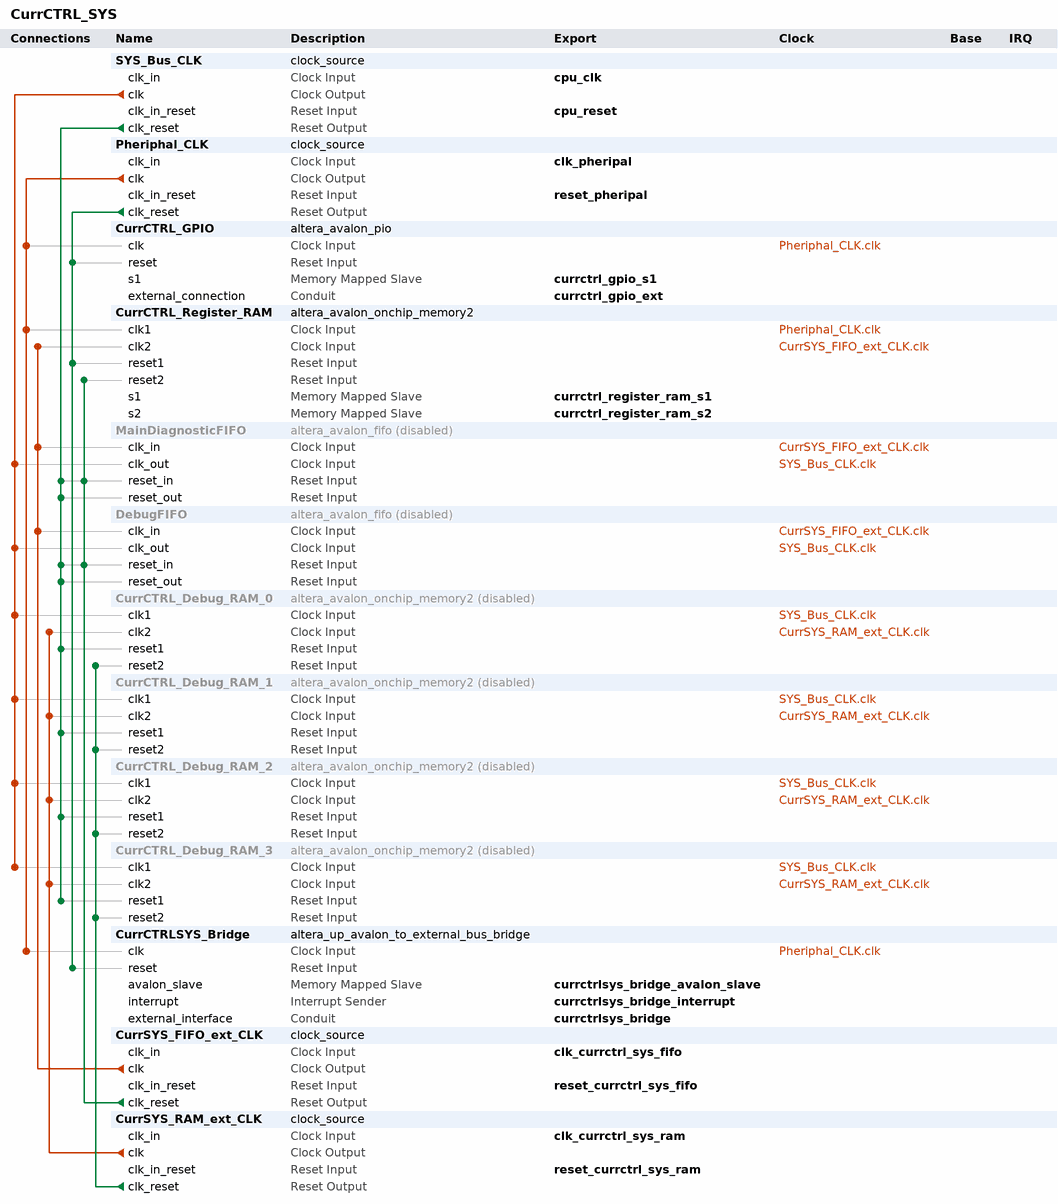
[diagram p0: system contents]
# Platform Designer (Qsys) system CurrCTRL_SYS, MAX 10 10M50DAF484I7G
# Parameters at their usual value, and those the tool derives, are not listed.
package require -exact qsys 18.1
create_system CurrCTRL_SYS
set_project_property DEVICE_FAMILY {MAX 10}
set_project_property DEVICE 10M50DAF484I7G

add_instance SYS_Bus_CLK clock_source 18.1
set_instance_parameter_value SYS_Bus_CLK clockFrequency 50000000

add_instance Pheriphal_CLK clock_source 18.1
set_instance_parameter_value Pheriphal_CLK clockFrequency 50000000

add_instance CurrCTRL_GPIO altera_avalon_pio 18.1
set_instance_parameter_value CurrCTRL_GPIO bitModifyingOutReg true
set_instance_parameter_value CurrCTRL_GPIO captureEdge true
set_instance_parameter_value CurrCTRL_GPIO direction InOut
set_instance_parameter_value CurrCTRL_GPIO edgeType FALLING
set_instance_parameter_value CurrCTRL_GPIO irqType EDGE
set_instance_parameter_value CurrCTRL_GPIO simDoTestBenchWiring true
set_instance_parameter_value CurrCTRL_GPIO width 32

add_instance CurrCTRL_Register_RAM altera_avalon_onchip_memory2 18.1
set_instance_parameter_value CurrCTRL_Register_RAM dataWidth 32
set_instance_parameter_value CurrCTRL_Register_RAM dualPort true
set_instance_parameter_value CurrCTRL_Register_RAM initMemContent false
set_instance_parameter_value CurrCTRL_Register_RAM initializationFileName onchip_mem.hex
set_instance_parameter_value CurrCTRL_Register_RAM memorySize 1024

add_instance MainDiagnosticFIFO altera_avalon_fifo 18.1
set_instance_property MainDiagnosticFIFO ENABLED false
set_instance_parameter_value MainDiagnosticFIFO bitsPerSymbol 16
set_instance_parameter_value MainDiagnosticFIFO channelWidth 8
set_instance_parameter_value MainDiagnosticFIFO errorWidth 8
set_instance_parameter_value MainDiagnosticFIFO fifoDepth 8192
set_instance_parameter_value MainDiagnosticFIFO fifoInputInterfaceOptions AVALONMM_WRITE
set_instance_parameter_value MainDiagnosticFIFO fifoOutputInterfaceOptions AVALONMM_READ
set_instance_parameter_value MainDiagnosticFIFO singleClockMode false
set_instance_parameter_value MainDiagnosticFIFO symbolsPerBeat 2
set_instance_parameter_value MainDiagnosticFIFO useBackpressure false
set_instance_parameter_value MainDiagnosticFIFO useIRQ false
set_instance_parameter_value MainDiagnosticFIFO usePacket true
set_instance_parameter_value MainDiagnosticFIFO useReadControl true
set_instance_parameter_value MainDiagnosticFIFO useWriteControl false

add_instance DebugFIFO altera_avalon_fifo 18.1
set_instance_property DebugFIFO ENABLED false
set_instance_parameter_value DebugFIFO bitsPerSymbol 16
set_instance_parameter_value DebugFIFO channelWidth 8
set_instance_parameter_value DebugFIFO errorWidth 8
set_instance_parameter_value DebugFIFO fifoDepth 8192
set_instance_parameter_value DebugFIFO fifoInputInterfaceOptions AVALONMM_WRITE
set_instance_parameter_value DebugFIFO fifoOutputInterfaceOptions AVALONMM_READ
set_instance_parameter_value DebugFIFO singleClockMode false
set_instance_parameter_value DebugFIFO symbolsPerBeat 2
set_instance_parameter_value DebugFIFO useBackpressure false
set_instance_parameter_value DebugFIFO useIRQ false
set_instance_parameter_value DebugFIFO usePacket true
set_instance_parameter_value DebugFIFO useReadControl true
set_instance_parameter_value DebugFIFO useWriteControl false

add_instance CurrCTRL_Debug_RAM_0 altera_avalon_onchip_memory2 18.1
set_instance_property CurrCTRL_Debug_RAM_0 ENABLED false
set_instance_parameter_value CurrCTRL_Debug_RAM_0 dataWidth 32
set_instance_parameter_value CurrCTRL_Debug_RAM_0 dualPort true
set_instance_parameter_value CurrCTRL_Debug_RAM_0 initMemContent false
set_instance_parameter_value CurrCTRL_Debug_RAM_0 initializationFileName onchip_mem.hex
set_instance_parameter_value CurrCTRL_Debug_RAM_0 memorySize 2048

add_instance CurrCTRL_Debug_RAM_1 altera_avalon_onchip_memory2 18.1
set_instance_property CurrCTRL_Debug_RAM_1 ENABLED false
set_instance_parameter_value CurrCTRL_Debug_RAM_1 dataWidth 32
set_instance_parameter_value CurrCTRL_Debug_RAM_1 dualPort true
set_instance_parameter_value CurrCTRL_Debug_RAM_1 initMemContent false
set_instance_parameter_value CurrCTRL_Debug_RAM_1 initializationFileName onchip_mem.hex
set_instance_parameter_value CurrCTRL_Debug_RAM_1 memorySize 2048

add_instance CurrCTRL_Debug_RAM_2 altera_avalon_onchip_memory2 18.1
set_instance_property CurrCTRL_Debug_RAM_2 ENABLED false
set_instance_parameter_value CurrCTRL_Debug_RAM_2 dataWidth 32
set_instance_parameter_value CurrCTRL_Debug_RAM_2 dualPort true
set_instance_parameter_value CurrCTRL_Debug_RAM_2 initMemContent false
set_instance_parameter_value CurrCTRL_Debug_RAM_2 initializationFileName onchip_mem.hex
set_instance_parameter_value CurrCTRL_Debug_RAM_2 memorySize 2048

add_instance CurrCTRL_Debug_RAM_3 altera_avalon_onchip_memory2 18.1
set_instance_property CurrCTRL_Debug_RAM_3 ENABLED false
set_instance_parameter_value CurrCTRL_Debug_RAM_3 dataWidth 32
set_instance_parameter_value CurrCTRL_Debug_RAM_3 dualPort true
set_instance_parameter_value CurrCTRL_Debug_RAM_3 initMemContent false
set_instance_parameter_value CurrCTRL_Debug_RAM_3 initializationFileName onchip_mem.hex
set_instance_parameter_value CurrCTRL_Debug_RAM_3 memorySize 2048

add_instance CurrCTRLSYS_Bridge altera_up_avalon_to_external_bus_bridge 18.0
set_instance_parameter_value CurrCTRLSYS_Bridge addr_size 128
set_instance_parameter_value CurrCTRLSYS_Bridge addr_size_multiplier bytes
set_instance_parameter_value CurrCTRLSYS_Bridge data_size 32

add_instance CurrSYS_FIFO_ext_CLK clock_source 18.1
set_instance_parameter_value CurrSYS_FIFO_ext_CLK clockFrequency 50000000

add_instance CurrSYS_RAM_ext_CLK clock_source 18.1
set_instance_parameter_value CurrSYS_RAM_ext_CLK clockFrequency 50000000

# connections
add_connection CurrSYS_FIFO_ext_CLK.clk CurrCTRL_Register_RAM.clk2 clock
add_connection CurrSYS_FIFO_ext_CLK.clk DebugFIFO.clk_in clock
add_connection CurrSYS_FIFO_ext_CLK.clk MainDiagnosticFIFO.clk_in clock
add_connection CurrSYS_RAM_ext_CLK.clk CurrCTRL_Debug_RAM_0.clk2 clock
add_connection CurrSYS_RAM_ext_CLK.clk CurrCTRL_Debug_RAM_1.clk2 clock
add_connection CurrSYS_RAM_ext_CLK.clk CurrCTRL_Debug_RAM_2.clk2 clock
add_connection CurrSYS_RAM_ext_CLK.clk CurrCTRL_Debug_RAM_3.clk2 clock
add_connection Pheriphal_CLK.clk CurrCTRL_GPIO.clk clock
add_connection Pheriphal_CLK.clk CurrCTRL_Register_RAM.clk1 clock
add_connection Pheriphal_CLK.clk CurrCTRLSYS_Bridge.clk clock
add_connection SYS_Bus_CLK.clk CurrCTRL_Debug_RAM_0.clk1 clock
add_connection SYS_Bus_CLK.clk CurrCTRL_Debug_RAM_1.clk1 clock
add_connection SYS_Bus_CLK.clk CurrCTRL_Debug_RAM_2.clk1 clock
add_connection SYS_Bus_CLK.clk CurrCTRL_Debug_RAM_3.clk1 clock
add_connection SYS_Bus_CLK.clk DebugFIFO.clk_out clock
add_connection SYS_Bus_CLK.clk MainDiagnosticFIFO.clk_out clock
add_connection CurrSYS_FIFO_ext_CLK.clk_reset CurrCTRL_Register_RAM.reset2 reset
add_connection CurrSYS_FIFO_ext_CLK.clk_reset DebugFIFO.reset_in reset
add_connection CurrSYS_FIFO_ext_CLK.clk_reset MainDiagnosticFIFO.reset_in reset
add_connection CurrSYS_RAM_ext_CLK.clk_reset CurrCTRL_Debug_RAM_0.reset2 reset
add_connection CurrSYS_RAM_ext_CLK.clk_reset CurrCTRL_Debug_RAM_1.reset2 reset
add_connection CurrSYS_RAM_ext_CLK.clk_reset CurrCTRL_Debug_RAM_2.reset2 reset
add_connection CurrSYS_RAM_ext_CLK.clk_reset CurrCTRL_Debug_RAM_3.reset2 reset
add_connection Pheriphal_CLK.clk_reset CurrCTRL_GPIO.reset reset
add_connection Pheriphal_CLK.clk_reset CurrCTRL_Register_RAM.reset1 reset
add_connection Pheriphal_CLK.clk_reset CurrCTRLSYS_Bridge.reset reset
add_connection SYS_Bus_CLK.clk_reset CurrCTRL_Debug_RAM_0.reset1 reset
add_connection SYS_Bus_CLK.clk_reset CurrCTRL_Debug_RAM_1.reset1 reset
add_connection SYS_Bus_CLK.clk_reset CurrCTRL_Debug_RAM_2.reset1 reset
add_connection SYS_Bus_CLK.clk_reset CurrCTRL_Debug_RAM_3.reset1 reset
add_connection SYS_Bus_CLK.clk_reset DebugFIFO.reset_in reset
add_connection SYS_Bus_CLK.clk_reset DebugFIFO.reset_out reset
add_connection SYS_Bus_CLK.clk_reset MainDiagnosticFIFO.reset_in reset
add_connection SYS_Bus_CLK.clk_reset MainDiagnosticFIFO.reset_out reset

# exported interfaces
add_interface clk_currctrl_sys_fifo clock sink
set_interface_property clk_currctrl_sys_fifo EXPORT_OF CurrSYS_FIFO_ext_CLK.clk_in
add_interface clk_currctrl_sys_ram clock sink
set_interface_property clk_currctrl_sys_ram EXPORT_OF CurrSYS_RAM_ext_CLK.clk_in
add_interface clk_pheripal clock sink
set_interface_property clk_pheripal EXPORT_OF Pheriphal_CLK.clk_in
add_interface cpu_clk clock sink
set_interface_property cpu_clk EXPORT_OF SYS_Bus_CLK.clk_in
add_interface cpu_reset reset sink
set_interface_property cpu_reset EXPORT_OF SYS_Bus_CLK.clk_in_reset
add_interface currctrl_gpio_ext conduit end
set_interface_property currctrl_gpio_ext EXPORT_OF CurrCTRL_GPIO.external_connection
add_interface currctrl_gpio_s1 avalon slave
set_interface_property currctrl_gpio_s1 EXPORT_OF CurrCTRL_GPIO.s1
add_interface currctrl_register_ram_s1 avalon slave
set_interface_property currctrl_register_ram_s1 EXPORT_OF CurrCTRL_Register_RAM.s1
add_interface currctrl_register_ram_s2 avalon slave
set_interface_property currctrl_register_ram_s2 EXPORT_OF CurrCTRL_Register_RAM.s2
add_interface currctrlsys_bridge conduit end
set_interface_property currctrlsys_bridge EXPORT_OF CurrCTRLSYS_Bridge.external_interface
add_interface currctrlsys_bridge_avalon_slave avalon slave
set_interface_property currctrlsys_bridge_avalon_slave EXPORT_OF CurrCTRLSYS_Bridge.avalon_slave
add_interface currctrlsys_bridge_interrupt interrupt sender
set_interface_property currctrlsys_bridge_interrupt EXPORT_OF CurrCTRLSYS_Bridge.interrupt
add_interface reset_currctrl_sys_fifo reset sink
set_interface_property reset_currctrl_sys_fifo EXPORT_OF CurrSYS_FIFO_ext_CLK.clk_in_reset
add_interface reset_currctrl_sys_ram reset sink
set_interface_property reset_currctrl_sys_ram EXPORT_OF CurrSYS_RAM_ext_CLK.clk_in_reset
add_interface reset_pheripal reset sink
set_interface_property reset_pheripal EXPORT_OF Pheriphal_CLK.clk_in_reset

set_interconnect_requirement {$system} qsys_mm.clockCrossingAdapter HANDSHAKE
set_interconnect_requirement {$system} qsys_mm.enableEccProtection FALSE
set_interconnect_requirement {$system} qsys_mm.insertDefaultSlave FALSE
set_interconnect_requirement {$system} qsys_mm.maxAdditionalLatency 1

save_system CurrCTRL_SYS.qsys
